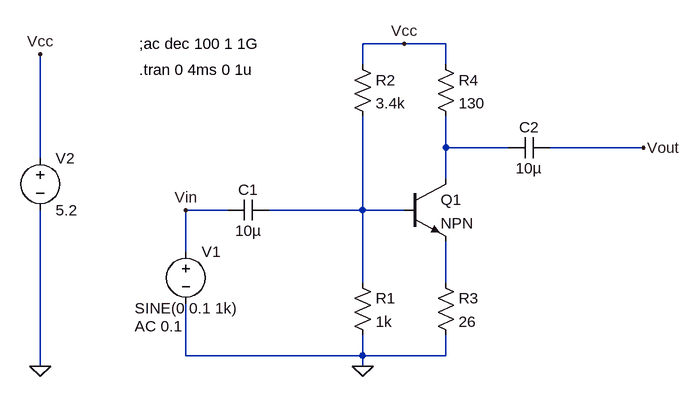
[diagram p0: schematic Audio Amplifier.asc]
Audio Amplifier.asc, the LTspice schematic file:
Version 4
SHEET 1 880 680
WIRE 144 -96 80 -96
WIRE 208 -96 144 -96
WIRE 80 -64 80 -96
WIRE 208 -64 208 -96
WIRE 208 64 208 16
WIRE 304 64 208 64
WIRE 512 64 368 64
WIRE -416 80 -416 -80
WIRE 208 112 208 64
WIRE -128 160 -192 160
WIRE 80 160 80 16
WIRE 80 160 -64 160
WIRE 144 160 80 160
WIRE -192 224 -192 160
WIRE 80 272 80 160
WIRE 208 272 208 208
WIRE -192 384 -192 304
WIRE 80 384 80 352
WIRE 80 384 -192 384
WIRE 208 384 208 352
WIRE 208 384 80 384
WIRE -416 400 -416 160
WIRE 80 400 80 384
FLAG 80 400 0
FLAG 144 -96 Vcc
FLAG -416 400 0
FLAG -416 -80 Vcc
FLAG 512 64 Vout
FLAG -192 160 Vin
SYMBOL npn 144 112 R0
SYMATTR InstName Q1
SYMBOL cap -64 144 R90
WINDOW 0 0 32 VBottom 2
WINDOW 3 32 32 VTop 2
SYMATTR InstName C1
SYMATTR Value 10µ
SYMBOL cap 368 48 R90
WINDOW 0 0 32 VBottom 2
WINDOW 3 32 32 VTop 2
SYMATTR InstName C2
SYMATTR Value 10µ
SYMBOL res 64 256 R0
SYMATTR InstName R1
SYMATTR Value 1k
SYMBOL res 64 -80 R0
SYMATTR InstName R2
SYMATTR Value 3.4k
SYMBOL res 192 256 R0
SYMATTR InstName R3
SYMATTR Value 26
SYMBOL res 192 -80 R0
SYMATTR InstName R4
SYMATTR Value 130
SYMBOL voltage -192 208 R0
WINDOW 3 -79 103 Left 2
WINDOW 123 -79 131 Left 2
WINDOW 39 0 0 Left 0
SYMATTR Value SINE(0 0.1 1k)
SYMATTR Value2 AC 0.1
SYMATTR InstName V1
SYMBOL voltage -416 64 R0
WINDOW 123 0 0 Left 0
WINDOW 39 0 0 Left 0
SYMATTR InstName V2
SYMATTR Value 5.2
TEXT -264 -56 Left 2 !.tran 0 4ms 0 1u
TEXT -264 -96 Left 2 !;ac dec 100 1 1G

The netlist it stands for:
* Audio Amplifier.asc
Q1 N001 N002 N003 0 NPN
C1 N002 Vin 10µ
C2 Vout N001 10µ
R1 N002 0 1k
R2 Vcc N002 3.4k
R3 N003 0 26
R4 Vcc N001 130
V1 Vin 0 SINE(0 0.1 1k) AC 0.1
V2 Vcc 0 5.2
.model NPN NPN
.model PNP PNP
.lib standard.bjt
.tran 0 4ms 0 1u
;ac dec 100 1 1G
.backanno
.end